# Altium project Suiveur.PrjPcb
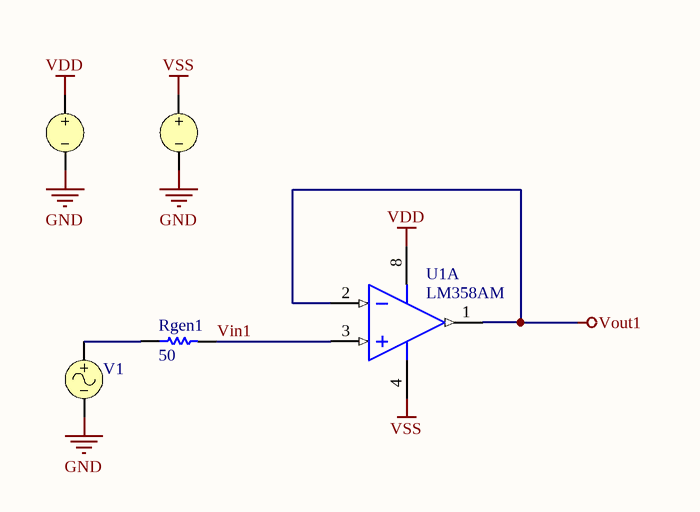
[diagram p0: Suiveur.SchDoc]
1 sheet, 5 parts. Net scope: global (net labels, ports and power ports of the same name join across sheets).

## Sheet Suiveur.SchDoc
size A4; SheetNumber: 1; SheetTotal: 1; SPICEModelCacheYCZDXKWJ: <root> / <DocumentId>YCZDXKWJ</DocumentId> / <CacheFrame Number="0"> / <Model Name="lm358" Kind="CKT"> / <Text>*////////////////////////////////////////////////////////// / *LM358 DUAL OPERATIONAL AMPLIFIER MACRO-MODEL / *////////////////////////////////////////////////////////// / * / * connections:      non-inverting input / *                   |   inverting input / *                   |   |   positive power supply / *                   |   |   |   negative power supply / *                   |   |   |   |   output / *                   |   |   |   |   | / *                   |   |   |   |   | / .SUBCKT LM358       1   2  99  50  28 / * / * PINOUT ORDER +IN -IN V+ V- OUT / * / * / *Features: / *Eliminates need for dual supplies / *Large DC voltage gain =             100dB / *High bandwidth =                     1MHz / *Low input offset voltage =            2mV / *Wide supply range =       +-1.5V to +-16V / * / *NOTE: Model is for single device only and simulated / *      supply current is 1/2 of total device current. / *      Output crossover distortion with dual supplies / *      is not modeled. / * / ****************INPUT STAGE************** / * / IOS 2 1 5N / *^Input offset current / R1 1 3 500K / R2 3 2 500K / I1 99 4 100U / R3 5 50 517 / R4 6 50 517 / Q1 5 2 4 QX / Q2 6 7 4 QX / *Fp2=1.2 MHz / C4 5 6 128.27P / * / ***********COMMON MODE EFFECT*********** / * / I2 99 50 75U / *^Quiescent supply current / EOS 7 1 POLY(1) 16 49 2E-3 1 / *Input offset voltage.^ / R8 99 49 60K / R9 49 50 60K / * / *********OUTPUT VOLTAGE LIMITING******** / V2 99 8 1.63 / D1 9 8 DX / D2 10 9 DX / V3 10 50 .635 / * / **************SECOND STAGE************** / * / EH 99 98 99 49 1 / G1 98 9 POLY(1) 5 6 0 9.8772E-4 0 .3459 / *Fp1=7.86 Hz / R5 98 9 101.2433MEG / C3 98 9 200P / * / ***************POLE STAGE*************** / * / *Fp=2 MHz / G3 98 15 9 49 1E-6 / R12 98 15 1MEG / C5 98 15 7.9577E-14 / * / *********COMMON-MODE ZERO STAGE********* / * / *Fpcm=10 KHz / G4 98 16 3 49 5.6234E-8 / L2 98 17 15.9M / R13 17 16 1K / * / **************OUTPUT STAGE************** / * / F6 50 99 POLY(1) V6 300U 1 / E1 99 23 99 15 1 / R16 24 23 17.5 / D5 26 24 DX / V6 26 22 .63V / R17 23 25 17.5 / D6 25 27 DX / V7 22 27 .63V / V5 22 21 0.27V / D4 21 15 DX / V4 20 22 0.27V / D3 15 20 DX / L3 22 28 500P / RL3 22 28 100K / * / ***************MODELS USED************** / * / .MODEL DX D(IS=1E-15) / .MODEL QX PNP(BF=1.111E3) / * / .ENDS</Text> / </Model> / </CacheFrame> / </root>

### Parts
Rgen1  value 50  (hidden comment: Resistor)
U1  LM358AM  [M08A_N]  (part A of 2)
V1  SIN(0 1 10k 0 0 0)  (value not drawn)
V+  DC 5  (value not drawn)
V-  DC -5  (value not drawn)

### Nets
GND: V1.2 V+.2 V-.2
VDD: U1.8(V+) V+.1
Vout1: U1.1(OUTA) U1.2(INA-)
VSS: U1.4(GND) V-.1
Vin1: Rgen1.2 U1.3(INA+)
NetRgen1_1: Rgen1.1 V1.1

### Library data of the parts
Rgen1 = Resistor: TC1: 0; SimulationGenericComponent: True; TC2: 0
U1 = LM358AM: Low Power Dual Operational Amplifier, 8-pin Narrow SOIC; Manufacturer: National Semiconductor; PackageTopMarking: NSZXTT*LM*358AM; PowerWise: N; CompType: Amplifiers; Published: 4-Dec-2008; LatestRevisionDate: 13-Jan-2009; LatestRevisionNote: Sim Model Added.; DatasheetVersion: Oct-2005; PackageVersion: revM, May-2009; PackageReference: M08A; Publisher: Altium Limited; PackageDescription: SOIC Narrow, 4.9 x 3.9 x 1.45mm, 8 Lead, 1.27mm Pitch; Supplier 1: Farnell; Supplier Part Number 1: 9486801; PartNumber: LM358AM; RoHS: N; PinCount: 8; Code_JEDEC: MS-012-AA; Code_IPC: SOIC127P600-8; ComponentLink1Description: LM358 Datasheet; ComponentLink1URL: http://www.national.com/ds/LM/LM358.pdf; ComponentLink2Description: LM358 Web Page; ComponentLink2URL: http://www.national.com/pf/LM/LM358.html; ComponentLink3Description: M08A Package Page; ComponentLink3URL: http://www.national.com/packaging/folders/m08a.html
V1 = VSIN: Sinusoidal Voltage Source; Note: PCB Footprint - Not required; Offset: 0; Amplitude: 1; Published: 8-Jun-2000; LatestRevisionDate: 15-Nov-2004; LatestRevisionNote: Corrected Netlist.; PackageReference: Not Applicable; Publisher: Altium Limited; Frequency: 10k; Delay: 0; Damping Factor: 0; Phase: 0; DC Magnitude: 0; AC Magnitude: 1; AC Phase: 0
V+ = VSRC: Voltage Source; Note: PCB Footprint - Not required; Value: 5; Published: 8-Jun-2000; LatestRevisionDate: 17-Jul-2002; LatestRevisionNote: Re-released for DXP Platform.; PackageReference: Not Applicable; Publisher: Altium Limited
V- = VSRC: Voltage Source; Note: PCB Footprint - Not required; Published: 8-Jun-2000; LatestRevisionDate: 17-Jul-2002; LatestRevisionNote: Re-released for DXP Platform.; PackageReference: Not Applicable; Publisher: Altium Limited; Value: -5